# EAGLE design usbc_adapter_2_0 (EAGLE 9.6.2)
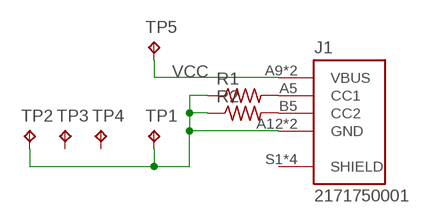
[diagram p0: schematic, sheet 1]

## Parts
J1  2171750001  [MOLEX_2171750001]
R1  R-US_R0603  [R0603]
R2  R-US_R0603  [R0603]
TP1  TPTP20R  [TP20R]
TP2  TPTP20R  [TP20R]
TP3  TPTP20R  [TP20R]
TP4  TPTP20R  [TP20R]
TP5  TPTP16R  [TP16R]

## Nets
GND: J1.A12(GND) J1.B12(GND) R1.1 R2.1 TP1.TP TP2.TP
N$1: J1.A5(CC1) R1.2
N$2: J1.B5(CC2) R2.2
VCC: J1.A9(VBUS) J1.B9(VBUS) TP5.TP
Unconnected: J1.S1(SHIELD) J1.S2(SHIELD) J1.S3(SHIELD) J1.S4(SHIELD) TP3.TP TP4.TP

## Library data of the parts
J1 = 2171750001:2171750001: USB-C (USB TYPE-C) USB 2.0 Receptacle Connector 24 (6+18 Dummy) Position Surface Mount, Right Angle; Through Hole Check availability <https://pricing.snapeda.com/parts/217175-0001/Molex/view-part?ref=eda>; AVAILABILITY: In Stock; DESCRIPTION: USB-C (USB TYPE-C) USB 2.0 Receptacle Connector 24 (6+18 Dummy) Position Surface Mount, Right Angle; Through Hole; MF: Molex; MP: 217175-0001; PACKAGE: None; PRICE: None; PURCHASE-URL: https://pricing.snapeda.com/search/part/217175-0001/?ref=eda
R1 R2 = adafruit:R-US_: RESISTOR, American symbol
TP1-TP5 = testpad:TP: Test pad

## Board
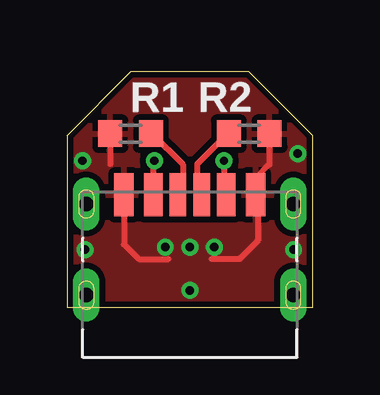
[diagram p1: board, top side]
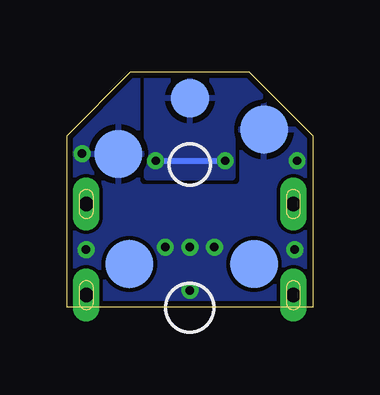
[diagram p2: board, bottom side, seen from below]

Size 10.25 x 9.8 mm. Coordinates in mm from the lower left corner, seen from the top.
Outline: 0,0 10.25,0 10.25,7.15 7.6,9.8 2.65,9.8 0,7.15 0,0
Copper layers (1*16): Top 0.0356mm / dielectric 1.5011mm / Bottom 0.0356mm
Design rules "jlcpcb *": minimum track width 8mil, minimum drill 13mil, track to track 6mil, track to pad 8mil, pad to pad 8mil, via to via 8mil, smd to smd 5mil, copper to edge 10mil, drill to drill 22mil, minimum pad ring 7mil, minimum via ring 7mil, stop-mask expansion 2.5mil, vias tented up to drill 14mil, thermal gap 10mil
bRestrict: area 0.5,-1 to 1.1,0.1; area 9.1,-1 to 9.8,0.1

### Footprints (pad centres in the part's own frame; a part is rotated, then mirrored left to right if it is on the bottom)
MOLEX_2171750001 = smd 0.7 x 1.8: A5 -0.5,4.18; B5 0.5,4.18 | smd 0.76 x 1.8: A9 1.52,4.18; B9 -1.52,4.18 | smd 0.8 x 1.8: A12 2.75,4.18; B12 -2.75,4.18 | drill 0.6 pad 1.1 long: S1 -4.32,0; S2 4.32,0; S3 -4.32,3.8; S4 4.32,3.8
R0603 = smd 1 x 1.1: 1 -0.85,0; 2 0.85,0
TP20R = smd 2 x 2: TP 0,0
TP16R = smd 1.6 x 1.6: TP 0,0

### Placement (x,y rotation side)
J1  5.12,0.5 0 top
R1  2.65,7.23 0 top
R2  7.6,7.23 180 top
TP1  8.1,6.38 0 bottom
TP2  2.03,7.4 0 bottom
TP3  7.65,1.8 0 bottom
TP4  2.45,1.8 0 bottom
TP5  5.12,8.7 0 bottom

### Tracks (layer width: path | path; a pad name or v marks a point on that pad's centre or on a via)
GND  (via drill 0.35)
  Top 0.25: J1.B12 2.3,4.3 | R1.1 1.8,5.96 | 2.38,5.38 J1.B12 | R2.1 8.45,5.95 7.88,5.38 J1.A12 7.96,4.3 7.96,2.76 7.2,2 6.03,2 | J1.B12 2.38,2.62 3,2 4.23,2
  other vias: 6.15,2.5 5.12,0.7 0.65,6.1 9.62,6.4 9.46,2.4 0.75,2.4 4.1,2.5 5.12,2.5
  pour Bottom (rank 6): -1.05,12 11.95,12 11.95,-2 -2.05,-2 -2.05,12
  pour Top (isolate 0.25, rank 6): 0.95,11 12.95,11 12.95,-2 -1.05,-2 -1.05,11
N$1
  Top 0.25: R1.2 3.55,7.23 4.83,5.95 4.83,4.58 J1.A5
N$2
  Top 0.25: R2.2 6.7,7.23 5.43,5.96 5.43,4.58 J1.B5
VCC  (via drill 0.35)
  Top 0.25: J1.B9 3.61,6.06 v3.65,6.1 | J1.A9 6.54,4.78 v6.55,6.1
  Bottom 0.25: 3.68,6.1 v3.65,6.1 v6.55,6.1
  pour Bottom (isolate 0.25): 0.9,10.05 3.35,7.6 3.35,5.4 6.9,5.4 6.9,10.45 0.9,10.45